# Altium schematic sheet FPGA_Top.SchDoc
size A1; SheetNumber: 1; SheetTotal: 1
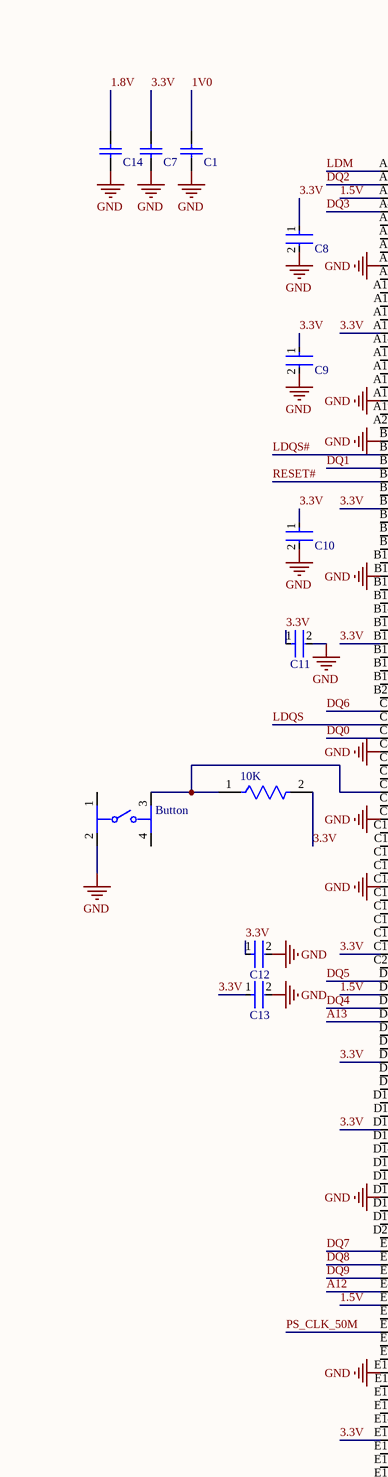
[diagram p0: FPGA_Top.SchDoc, top left]
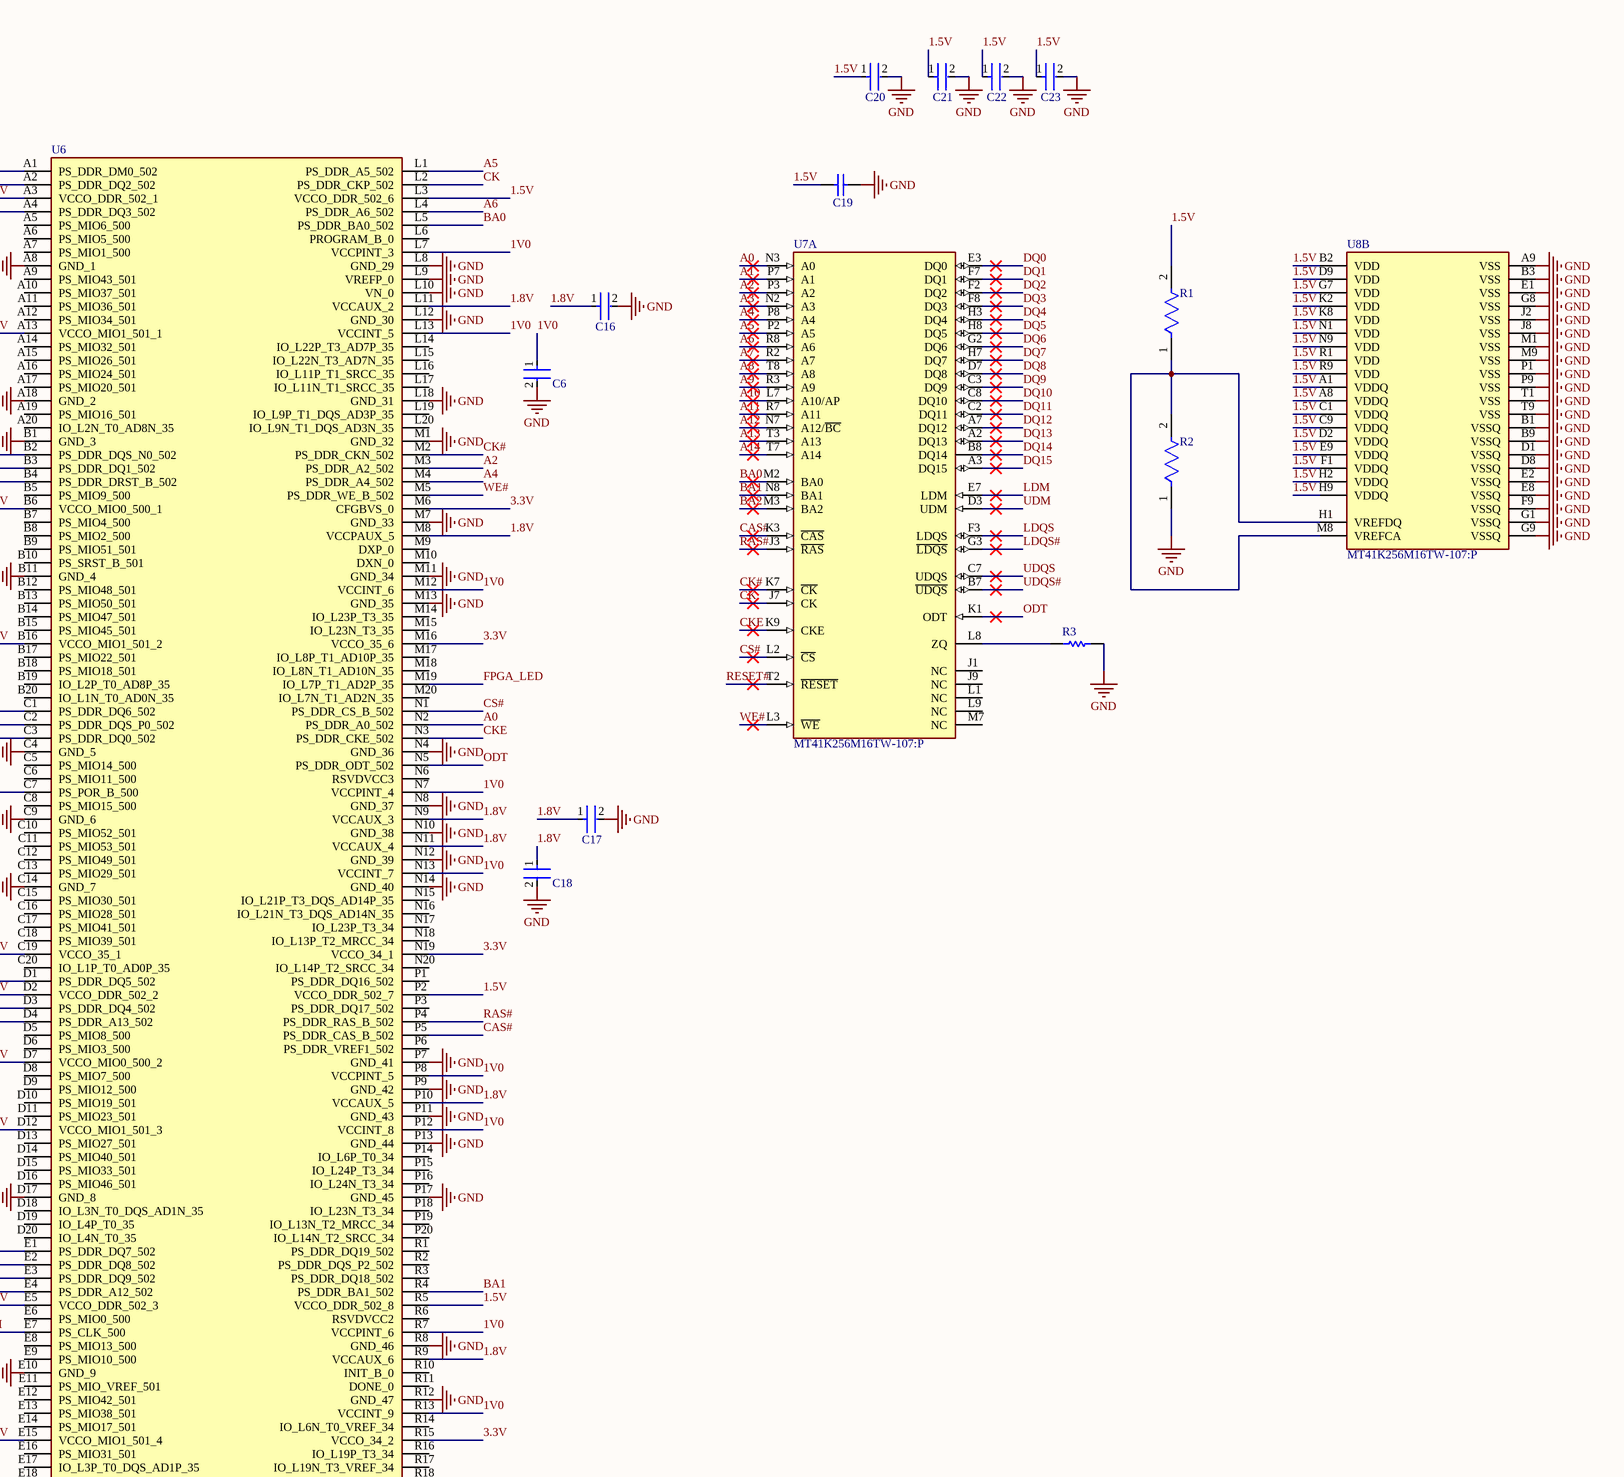
[diagram p1: FPGA_Top.SchDoc, top right]
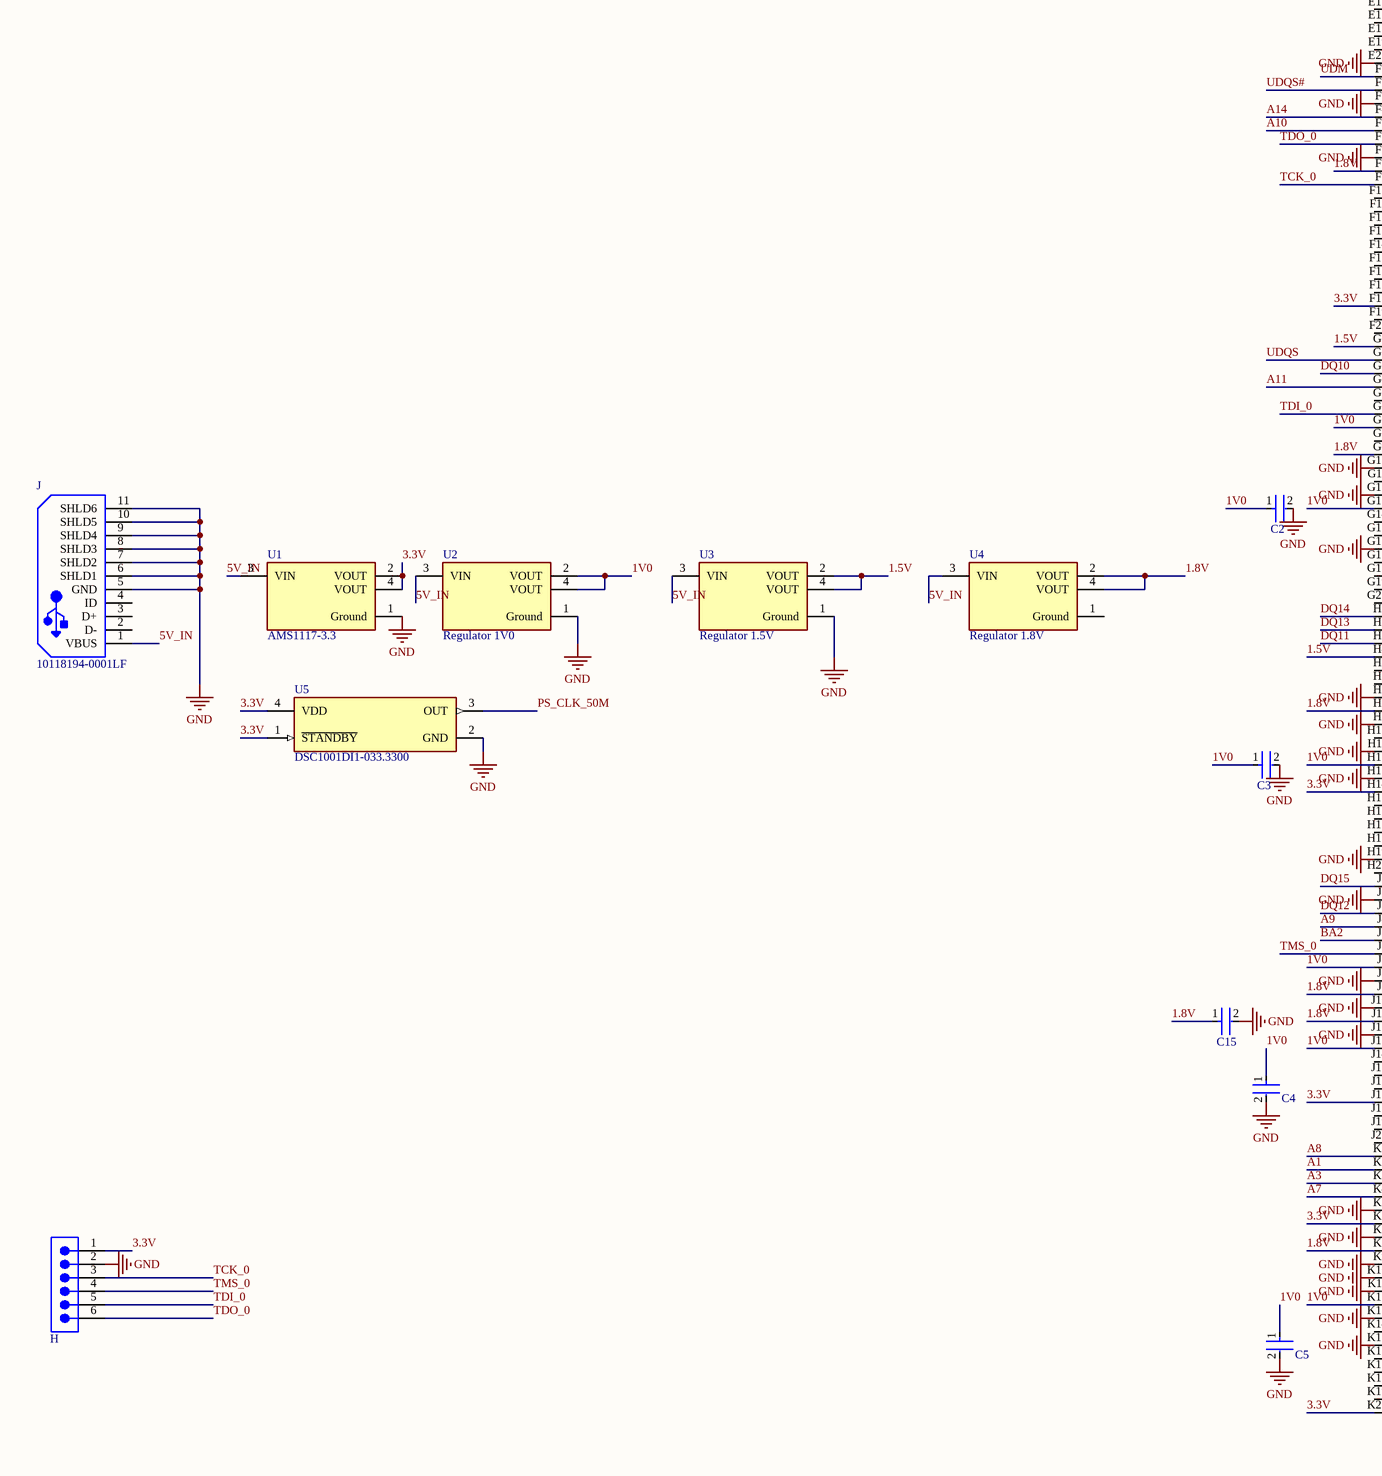
[diagram p2: FPGA_Top.SchDoc, bottom left]
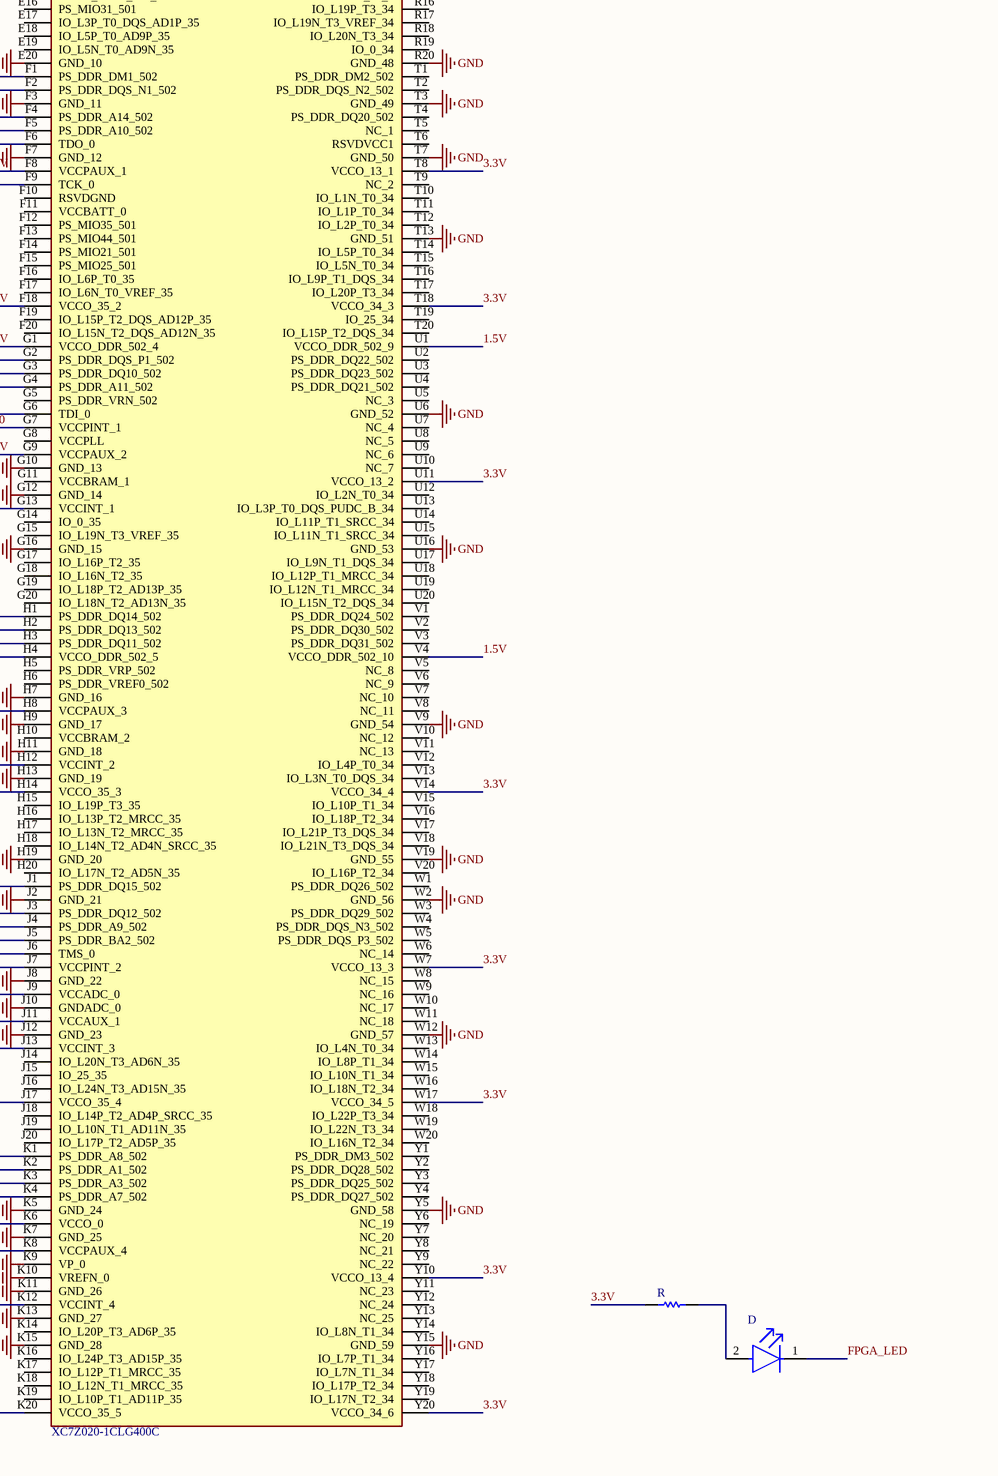
[diagram p3: FPGA_Top.SchDoc, bottom right]

## Parts
10K  RC0402JR-0710KL  [FP-RC0402-0_4-IPC_C]  (value not drawn)
Button  4-1437565-1  [FP-4-1437565-1-MFG]  (value not drawn)
C1  CL10A475KQ8NNNC  [CAPC1608X90X30LL10T20]  (value not drawn)
C2  CC0402KRX7R9BB104  [FP-CC0402-MFG]  (value not drawn)
C3  CC0402KRX7R9BB104  [FP-CC0402-MFG]  (value not drawn)
C4  CC0402KRX7R9BB104  [FP-CC0402-MFG]  (value not drawn)
C5  CC0402KRX7R9BB104  [FP-CC0402-MFG]  (value not drawn)
C6  CC0402KRX7R9BB104  [FP-CC0402-MFG]  (value not drawn)
C7  CL10A475KQ8NNNC  [CAPC1608X90X30LL10T20]  (value not drawn)
C8  CC0402KRX7R9BB104  [FP-CC0402-MFG]  (value not drawn)
C9  CC0402KRX7R9BB104  [FP-CC0402-MFG]  (value not drawn)
C10  CC0402KRX7R9BB104  [FP-CC0402-MFG]  (value not drawn)
C11  CC0402KRX7R9BB104  [FP-CC0402-MFG]  (value not drawn)
C12  CC0402KRX7R9BB104  [FP-CC0402-MFG]  (value not drawn)
C13  CC0402KRX7R9BB104  [FP-CC0402-MFG]  (value not drawn)
C14  CL10A475KQ8NNNC  [CAPC1608X90X30LL10T20]  (value not drawn)
C15  CC0402KRX7R9BB104  [FP-CC0402-MFG]  (value not drawn)
C16  CC0402KRX7R9BB104  [FP-CC0402-MFG]  (value not drawn)
C17  CC0402KRX7R9BB104  [FP-CC0402-MFG]  (value not drawn)
C18  CC0402KRX7R9BB104  [FP-CC0402-MFG]  (value not drawn)
C19  CL10A475KQ8NNNC  [CAPC1608X90X30LL10T20]  (value not drawn)
C20  CC0402KRX7R9BB104  [FP-CC0402-MFG]  (value not drawn)
C21  CC0402KRX7R9BB104  [FP-CC0402-MFG]  (value not drawn)
C22  CC0402KRX7R9BB104  [FP-CC0402-MFG]  (value not drawn)
C23  CC0402KRX7R9BB104  [FP-CC0402-MFG]  (value not drawn)
D  LTST-C190KRKT  [FP-LTST-C190KRKT-MFG]  (value not drawn)
H  TSW-106-07-G-S  [SMTC-TSW-106-07-X-S]  (value not drawn)
J  10118194-0001LF  [FCI-10118194-0001LF-5_V]
R  RC0402JR-07330RL  [RESC1005X40X25NL05T10]  (value not drawn)
R1  RC0402FR-071KL  [FP-RC0402-0_4-IPC_A]  (value not drawn)
R2  RC0402FR-071KL  [FP-RC0402-0_4-IPC_A]  (value not drawn)
R3  240R 1% 0402(1005)  [RESC0402(1005)_L]  (value not drawn)
U1  AMS1117-3.3  [FP-AMS1117-IPC_C]
U2  Regulator 1V0  [FP-AMS1117-IPC_C]
U3  Regulator 1.5V  [FP-AMS1117-IPC_C]
U4  Regulator 1.8V  [FP-AMS1117-IPC_C]
U5  DSC1001DI1-033.3300  [FP-CDFN2520-4LD-PL-1-MFG]
U6  XC7Z020-1CLG400C  [BGA400C80P20X20_1700X1700X160]
U7  MT41K256M16TW-107:P  [FP-TW-IPC_C]  (part A of 2)
U8  MT41K256M16TW-107:P  [FP-TW-IPC_C]  (part B of 2)

## Nets
GND: Button.2 C1.1 C2.2 C3.2 C4.2 C5.2 C6.2 C7.1 C8.2 C9.2 C10.2 C11.2 C12.2 C13.2 C14.1 C15.2 C16.2 C17.2 C18.2 C19.1 C20.2 C21.2 C22.2 C23.2 H.2 J.5(GND) J.6(SHLD1) J.7(SHLD2) J.8(SHLD3) J.9(SHLD4) J.10(SHLD5) J.11(SHLD6) R2.1 R3.2 U1.1(Ground) U2.1(Ground) U3.1(Ground) U5.2(GND) U6.A8(GND_1) U6.A18(GND_2) U6.B1(GND_3) U6.B11(GND_4) U6.C4(GND_5) U6.C9(GND_6) U6.C14(GND_7) U6.D17(GND_8) U6.E10(GND_9) U6.E20(GND_10) U6.F3(GND_11) U6.F7(GND_12) U6.G10(GND_13) U6.G12(GND_14) U6.G16(GND_15) U6.H7(GND_16) U6.H9(GND_17) U6.H11(GND_18) U6.H13(GND_19) U6.H19(GND_20) U6.J2(GND_21) U6.J8(GND_22) U6.J10(GNDADC_0) U6.J12(GND_23) U6.K5(GND_24) U6.K7(GND_25) U6.K9(VP_0) U6.K10(VREFN_0) U6.K11(GND_26) U6.K13(GND_27) U6.K15(GND_28) U6.L8(GND_29) U6.L9(VREFP_0) U6.L10(VN_0) U6.L12(GND_30) U6.L18(GND_31) U6.M1(GND_32) U6.M7(GND_33) U6.M11(GND_34) U6.M13(GND_35) U6.N4(GND_36) U6.N8(GND_37) U6.N10(GND_38) U6.N12(GND_39) U6.N14(GND_40) U6.P7(GND_41) U6.P9(GND_42) U6.P11(GND_43) U6.P13(GND_44) U6.P17(GND_45) U6.R8(GND_46) U6.R12(GND_47) U6.R20(GND_48) U6.T3(GND_49) U6.T7(GND_50) U6.T13(GND_51) U6.U6(GND_52) U6.U16(GND_53) U6.V9(GND_54) U6.V19(GND_55) U6.W2(GND_56) U6.W12(GND_57) U6.Y5(GND_58) U6.Y15(GND_59) U8.A9(VSS) U8.B1(VSSQ) U8.B3(VSS) U8.B9(VSSQ) U8.D1(VSSQ) U8.D8(VSSQ) U8.E1(VSS) U8.E2(VSSQ) U8.E8(VSSQ) U8.F9(VSSQ) U8.G1(VSSQ) U8.G8(VSS) U8.G9(VSSQ) U8.J2(VSS) U8.J8(VSS) U8.M1(VSS) U8.M9(VSS) U8.P1(VSS) U8.P9(VSS) U8.T1(VSS) U8.T9(VSS)
1.5V: C19.2 C20.1 C21.1 C22.1 C23.1 R1.2 U3.2(VOUT) U3.4(VOUT) U6.A3(VCCO_DDR_502_1) U6.D2(VCCO_DDR_502_2) U6.E5(VCCO_DDR_502_3) U6.G1(VCCO_DDR_502_4) U6.H4(VCCO_DDR_502_5) U6.L3(VCCO_DDR_502_6) U6.P2(VCCO_DDR_502_7) U6.R5(VCCO_DDR_502_8) U6.U1(VCCO_DDR_502_9) U6.V4(VCCO_DDR_502_10) U8.A1(VDDQ) U8.A8(VDDQ) U8.B2(VDD) U8.C1(VDDQ) U8.C9(VDDQ) U8.D2(VDDQ) U8.D9(VDD) U8.E9(VDDQ) U8.F1(VDDQ) U8.G7(VDD) U8.H2(VDDQ) U8.H9(VDDQ) U8.K2(VDD) U8.K8(VDD) U8.N1(VDD) U8.N9(VDD) U8.R1(VDD) U8.R9(VDD)
1.8V: C14.2 C15.1 C16.1 C17.1 C18.1 U4.2(VOUT) U4.4(VOUT) U6.F8(VCCPAUX_1) U6.G9(VCCPAUX_2) U6.H8(VCCPAUX_3) U6.J9(VCCADC_0) U6.J11(VCCAUX_1) U6.K8(VCCPAUX_4) U6.L11(VCCAUX_2) U6.M8(VCCPAUX_5) U6.N9(VCCAUX_3) U6.N11(VCCAUX_4) U6.P10(VCCAUX_5) U6.R9(VCCAUX_6)
1V0: C1.2 C2.1 C3.1 C4.1 C5.1 C6.1 U2.2(VOUT) U2.4(VOUT) U6.G7(VCCPINT_1) U6.G13(VCCINT_1) U6.H12(VCCINT_2) U6.J7(VCCPINT_2) U6.J13(VCCINT_3) U6.K12(VCCINT_4) U6.L7(VCCPINT_3) U6.L13(VCCINT_5) U6.M12(VCCINT_6) U6.N7(VCCPINT_4) U6.N13(VCCINT_7) U6.P8(VCCPINT_5) U6.P12(VCCINT_8) U6.R7(VCCPINT_6) U6.R13(VCCINT_9)
3.3V: 10K.2 C7.2 C8.1 C9.1 C10.1 C11.1 C12.1 C13.1 H.1 R.1 U1.2(VOUT) U1.4(VOUT) U5.1(~{STANDBY}) U5.4(VDD) U6.A13(VCCO_MIO1_501_1) U6.B6(VCCO_MIO0_500_1) U6.B16(VCCO_MIO1_501_2) U6.C19(VCCO_35_1) U6.D7(VCCO_MIO0_500_2) U6.D12(VCCO_MIO1_501_3) U6.E15(VCCO_MIO1_501_4) U6.F18(VCCO_35_2) U6.H14(VCCO_35_3) U6.J17(VCCO_35_4) U6.K6(VCCO_0) U6.K20(VCCO_35_5) U6.M6(CFGBVS_0) U6.M16(VCCO_35_6) U6.N19(VCCO_34_1) U6.R15(VCCO_34_2) U6.T8(VCCO_13_1) U6.T18(VCCO_34_3) U6.U11(VCCO_13_2) U6.V14(VCCO_34_4) U6.W7(VCCO_13_3) U6.W17(VCCO_34_5) U6.Y10(VCCO_13_4) U6.Y20(VCCO_34_6)
5V_IN: J.1(VBUS) U1.3(VIN) U2.3(VIN) U3.3(VIN) U4.3(VIN)
A0: U6.N2(PS_DDR_A0_502) U7.N3(A0)
A1: U6.K2(PS_DDR_A1_502) U7.P7(A1)
A2: U6.M3(PS_DDR_A2_502) U7.P3(A2)
A3: U6.K3(PS_DDR_A3_502) U7.N2(A3)
A4: U6.M4(PS_DDR_A4_502) U7.P8(A4)
A5: U6.L1(PS_DDR_A5_502) U7.P2(A5)
A6: U6.L4(PS_DDR_A6_502) U7.R8(A6)
A7: U6.K4(PS_DDR_A7_502) U7.R2(A7)
A8: U6.K1(PS_DDR_A8_502) U7.T8(A8)
A9: U6.J4(PS_DDR_A9_502) U7.R3(A9)
A10: U6.F5(PS_DDR_A10_502) U7.L7(A10/AP)
A11: U6.G4(PS_DDR_A11_502) U7.R7(A11)
A12: U6.E4(PS_DDR_A12_502) U7.N7(A12/~{BC})
A13: U6.D4(PS_DDR_A13_502) U7.T3(A13)
A14: U6.F4(PS_DDR_A14_502) U7.T7(A14)
BA0: U6.L5(PS_DDR_BA0_502) U7.M2(BA0)
BA1: U6.R4(PS_DDR_BA1_502) U7.N8(BA1)
BA2: U6.J5(PS_DDR_BA2_502) U7.M3(BA2)
CAS#: U6.P5(PS_DDR_CAS_B_502) U7.K3(~{CAS})
CK: U6.L2(PS_DDR_CKP_502) U7.J7(CK)
CK#: U6.M2(PS_DDR_CKN_502) U7.K7(~{CK})
CKE: U6.N3(PS_DDR_CKE_502) U7.K9(CKE)
CS#: U6.N1(PS_DDR_CS_B_502) U7.L2(~{CS})
DQ0: U6.C3(PS_DDR_DQ0_502) U7.E3(DQ0)
DQ1: U6.B3(PS_DDR_DQ1_502) U7.F7(DQ1)
DQ2: U6.A2(PS_DDR_DQ2_502) U7.F2(DQ2)
DQ3: U6.A4(PS_DDR_DQ3_502) U7.F8(DQ3)
DQ4: U6.D3(PS_DDR_DQ4_502) U7.H3(DQ4)
DQ5: U6.D1(PS_DDR_DQ5_502) U7.H8(DQ5)
DQ6: U6.C1(PS_DDR_DQ6_502) U7.G2(DQ6)
DQ7: U6.E1(PS_DDR_DQ7_502) U7.H7(DQ7)
DQ8: U6.E2(PS_DDR_DQ8_502) U7.D7(DQ8)
DQ9: U6.E3(PS_DDR_DQ9_502) U7.C3(DQ9)
DQ10: U6.G3(PS_DDR_DQ10_502) U7.C8(DQ10)
DQ11: U6.H3(PS_DDR_DQ11_502) U7.C2(DQ11)
DQ12: U6.J3(PS_DDR_DQ12_502) U7.A7(DQ12)
DQ13: U6.H2(PS_DDR_DQ13_502) U7.A2(DQ13)
DQ14: U6.H1(PS_DDR_DQ14_502) U7.B8(DQ14)
DQ15: U6.J1(PS_DDR_DQ15_502) U7.A3(DQ15)
FPGA_LED: D.1(C) U6.M19(IO_L7P_T1_AD2P_35)
LDM: U6.A1(PS_DDR_DM0_502) U7.E7(LDM)
LDQS: U6.C2(PS_DDR_DQS_P0_502) U7.F3(LDQS)
LDQS#: U6.B2(PS_DDR_DQS_N0_502) U7.G3(~{LDQS})
ODT: U6.N5(PS_DDR_ODT_502) U7.K1(ODT)
PS_CLK_50M: U5.3(OUT) U6.E7(PS_CLK_500)
RAS#: U6.P4(PS_DDR_RAS_B_502) U7.J3(~{RAS})
RESET#: U6.B4(PS_DDR_DRST_B_502) U7.T2(~{RESET})
TCK_0: H.3 U6.F9(TCK_0)
TDI_0: H.5 U6.G6(TDI_0)
TDO_0: H.6 U6.F6(TDO_0)
TMS_0: H.4 U6.J6(TMS_0)
UDM: U6.F1(PS_DDR_DM1_502) U7.D3(UDM)
UDQS: U6.G2(PS_DDR_DQS_P1_502) U7.C7(UDQS)
UDQS#: U6.F2(PS_DDR_DQS_N1_502) U7.B7(~{UDQS})
WE#: U6.M5(PS_DDR_WE_B_502) U7.L3(~{WE})
Net10K_1: 10K.1 Button.3 U6.C7(PS_POR_B_500)
NetD_2: D.2(A) R.2
NetR1_1: R1.1 R2.2 U8.H1(VREFDQ) U8.M8(VREFCA)
NetR3_1: R3.1 U7.L8(ZQ)

Not connected (* = marked no-connect by the designer): Button 1 4; J 2(D-) 3(D+) 4(ID); U4 1(Ground); U6 A5(PS_MIO6_500) A6(PS_MIO5_500) A7(PS_MIO1_500) A9(PS_MIO43_501) A10(PS_MIO37_501) A11(PS_MIO36_501) A12(PS_MIO34_501) A14(PS_MIO32_501) A15(PS_MIO26_501) A16(PS_MIO24_501) A17(PS_MIO20_501) A19(PS_MIO16_501) A20(IO_L2N_T0_AD8N_35) B5(PS_MIO9_500) B7(PS_MIO4_500) B8(PS_MIO2_500) B9(PS_MIO51_501) B10(PS_SRST_B_501) B12(PS_MIO48_501) B13(PS_MIO50_501) B14(PS_MIO47_501) B15(PS_MIO45_501) B17(PS_MIO22_501) B18(PS_MIO18_501) B19(IO_L2P_T0_AD8P_35) B20(IO_L1N_T0_AD0N_35) C5(PS_MIO14_500) C6(PS_MIO11_500) C8(PS_MIO15_500) C10(PS_MIO52_501) C11(PS_MIO53_501) C12(PS_MIO49_501) C13(PS_MIO29_501) C15(PS_MIO30_501) C16(PS_MIO28_501) C17(PS_MIO41_501) C18(PS_MIO39_501) C20(IO_L1P_T0_AD0P_35) D5(PS_MIO8_500) D6(PS_MIO3_500) D8(PS_MIO7_500) D9(PS_MIO12_500) D10(PS_MIO19_501) D11(PS_MIO23_501) D13(PS_MIO27_501) D14(PS_MIO40_501) D15(PS_MIO33_501) D16(PS_MIO46_501) D18(IO_L3N_T0_DQS_AD1N_35) D19(IO_L4P_T0_35) D20(IO_L4N_T0_35) E6(PS_MIO0_500) E8(PS_MIO13_500) E9(PS_MIO10_500) E11(PS_MIO_VREF_501) E12(PS_MIO42_501) E13(PS_MIO38_501) E14(PS_MIO17_501) E16(PS_MIO31_501) E17(IO_L3P_T0_DQS_AD1P_35) E18(IO_L5P_T0_AD9P_35) E19(IO_L5N_T0_AD9N_35) F10(RSVDGND) F11(VCCBATT_0) F12(PS_MIO35_501) F13(PS_MIO44_501) F14(PS_MIO21_501) F15(PS_MIO25_501) F16(IO_L6P_T0_35) F17(IO_L6N_T0_VREF_35) F19(IO_L15P_T2_DQS_AD12P_35) F20(IO_L15N_T2_DQS_AD12N_35) G5(PS_DDR_VRN_502) G8(VCCPLL) G11(VCCBRAM_1) G14(IO_0_35) G15(IO_L19N_T3_VREF_35) G17(IO_L16P_T2_35) G18(IO_L16N_T2_35) G19(IO_L18P_T2_AD13P_35) G20(IO_L18N_T2_AD13N_35) H5(PS_DDR_VRP_502) H6(PS_DDR_VREF0_502) H10(VCCBRAM_2) H15(IO_L19P_T3_35) H16(IO_L13P_T2_MRCC_35) H17(IO_L13N_T2_MRCC_35) H18(IO_L14N_T2_AD4N_SRCC_35) H20(IO_L17N_T2_AD5N_35) J14(IO_L20N_T3_AD6N_35) J15(IO_25_35) J16(IO_L24N_T3_AD15N_35) J18(IO_L14P_T2_AD4P_SRCC_35) J19(IO_L10N_T1_AD11N_35) J20(IO_L17P_T2_AD5P_35) K14(IO_L20P_T3_AD6P_35) K16(IO_L24P_T3_AD15P_35) K17(IO_L12P_T1_MRCC_35) K18(IO_L12N_T1_MRCC_35) K19(IO_L10P_T1_AD11P_35) L6(PROGRAM_B_0) L14(IO_L22P_T3_AD7P_35) L15(IO_L22N_T3_AD7N_35) L16(IO_L11P_T1_SRCC_35) L17(IO_L11N_T1_SRCC_35) L19(IO_L9P_T1_DQS_AD3P_35) L20(IO_L9N_T1_DQS_AD3N_35) M9(DXP_0) M10(DXN_0) M14(IO_L23P_T3_35) M15(IO_L23N_T3_35) M17(IO_L8P_T1_AD10P_35) M18(IO_L8N_T1_AD10N_35) M20(IO_L7N_T1_AD2N_35) N6(RSVDVCC3) N15(IO_L21P_T3_DQS_AD14P_35) N16(IO_L21N_T3_DQS_AD14N_35) N17(IO_L23P_T3_34) N18(IO_L13P_T2_MRCC_34) N20(IO_L14P_T2_SRCC_34) P1(PS_DDR_DQ16_502) P3(PS_DDR_DQ17_502) P6(PS_DDR_VREF1_502) P14(IO_L6P_T0_34) P15(IO_L24P_T3_34) P16(IO_L24N_T3_34) P18(IO_L23N_T3_34) P19(IO_L13N_T2_MRCC_34) P20(IO_L14N_T2_SRCC_34) R1(PS_DDR_DQ19_502) R2(PS_DDR_DQS_P2_502) R3(PS_DDR_DQ18_502) R6(RSVDVCC2) R10(INIT_B_0) R11(DONE_0) R14(IO_L6N_T0_VREF_34) R16(IO_L19P_T3_34) R17(IO_L19N_T3_VREF_34) R18(IO_L20N_T3_34) R19(IO_0_34) T1(PS_DDR_DM2_502) T2(PS_DDR_DQS_N2_502) T4(PS_DDR_DQ20_502) T5(NC_1) T6(RSVDVCC1) T9(NC_2) T10(IO_L1N_T0_34) T11(IO_L1P_T0_34) T12(IO_L2P_T0_34) T14(IO_L5P_T0_34) T15(IO_L5N_T0_34) T16(IO_L9P_T1_DQS_34) T17(IO_L20P_T3_34) T19(IO_25_34) T20(IO_L15P_T2_DQS_34) U2(PS_DDR_DQ22_502) U3(PS_DDR_DQ23_502) U4(PS_DDR_DQ21_502) U5(NC_3) U7(NC_4) U8(NC_5) U9(NC_6) U10(NC_7) U12(IO_L2N_T0_34) U13(IO_L3P_T0_DQS_PUDC_B_34) U14(IO_L11P_T1_SRCC_34) U15(IO_L11N_T1_SRCC_34) U17(IO_L9N_T1_DQS_34) U18(IO_L12P_T1_MRCC_34) U19(IO_L12N_T1_MRCC_34) U20(IO_L15N_T2_DQS_34) V1(PS_DDR_DQ24_502) V2(PS_DDR_DQ30_502) V3(PS_DDR_DQ31_502) V5(NC_8) V6(NC_9) V7(NC_10) V8(NC_11) V10(NC_12) V11(NC_13) V12(IO_L4P_T0_34) V13(IO_L3N_T0_DQS_34) V15(IO_L10P_T1_34) V16(IO_L18P_T2_34) V17(IO_L21P_T3_DQS_34) V18(IO_L21N_T3_DQS_34) V20(IO_L16P_T2_34) W1(PS_DDR_DQ26_502) W3(PS_DDR_DQ29_502) W4(PS_DDR_DQS_N3_502) W5(PS_DDR_DQS_P3_502) W6(NC_14) W8(NC_15) W9(NC_16) W10(NC_17) W11(NC_18) W13(IO_L4N_T0_34) W14(IO_L8P_T1_34) W15(IO_L10N_T1_34) W16(IO_L18N_T2_34) W18(IO_L22P_T3_34) W19(IO_L22N_T3_34) W20(IO_L16N_T2_34) Y1(PS_DDR_DM3_502) Y2(PS_DDR_DQ28_502) Y3(PS_DDR_DQ25_502) Y4(PS_DDR_DQ27_502) Y6(NC_19) Y7(NC_20) Y8(NC_21) Y9(NC_22) Y11(NC_23) Y12(NC_24) Y13(NC_25) Y14(IO_L8N_T1_34) Y16(IO_L7P_T1_34) Y17(IO_L7N_T1_34) Y18(IO_L17P_T2_34) Y19(IO_L17N_T2_34); U7 J1(NC) J9(NC) L1(NC) L9(NC) M7(NC)

## Library data of the parts
10K = CMP-2002-07915-3: RES 10K OHM 5% 1/16W 0402; Max Power Dissipation: 63mW; Temperature Coefficient: 100ppm/°C; Power Rating: 62.5mW; Resistance: 10kR; Voltage Rating: 50V; Size Code: 0402; Resistance Tolerance: 5%; Packaging: Tape and Reel; Case Code (Metric): 1005; Lead Free: Lead Free; Resistor Type: Thick Film; Min Operating Temperature: -55°C; Military Standard: Not; Depth: 0.5mm; Series: RC; Case/Package: 0402; Construction: Rectangular; Number of Terminations: 2; Package Quantity: 1; Termination: SMD/SMT; Length: 0.039inch; Case Code (Imperial): 0402; Height: 0.016inch; Features: Moisture Resistant; RoHS Compliant: Yes; Max Operating Temperature: 155°C; Tolerance: 5%; Width: 0.02inch
Button = CMP-03407-000003-1: SWITCH TACTILE SPST-NO 0.05A 24V; Manufacturer: TE Connectivity; Ciiva Ids: 2672442; Contact Current Rating: 50mA; Operating Force: 160gf; Contact Resistance: 100mΩ; Electromechanical Life: 100000Cycles; Standoff Height: 0.05mm; Import Ts: 1521848451; Category: Switch; ComponentLink2Description: Datasheet; Mount: Surface Mount; Digikey Description: SWITCH TACTILE SPST-NO 0.05A 24V; Device Class L3: Tactile Switches; Release Date: 1503379960; Octopart: https://octopart.com/fsm4jsma-te+connectivity-55488004; Temperature Range Low: -35°C; Lead Free: Yes; RoHS: TRUE; Mouser Description: Switch Tactile OFF (ON) SPST Round Button Gull Wing 0.05A 12VDC 1.57N SMD Loose Piece; Voltage Rating Dc: 24V; ComponentLink2URL: https://www.te.com/commerce/DocumentDelivery/DDEController?Action=showdoc&DocId=Customer+Drawing%7F2-1437565-7%7FV%7Fpdf%7FEnglish%7FENG_CD_2-1437565-7_V.pdf%7F4-1437565-1; Height: 5.38mm; Package: 0; Temperature Range High: +85°C; Device Class L2: Switches; Manufacturer Part Number: 4-1437565-1; Temperature: -35°C to +85°C; Device Class L1: Electromechanical; Automotive: No; Throw Configuration: SPST-NO
C1 C7 C14 C19 = CMP-2000-06090-1: Chip Capacitor, 4.7 uF, +/- 10%, 6.3 V, -55 to 85 degC, 0603 (1608 Metric), RoHS, Tape and Reel; Manufacturer: Samsung Electro-Mechanics; Dielectric: X5R; Capacitance: 4700000pF; Rated Voltage: 6.3V; Manufacturer URL: http://www.samsungsem.com/global/index.jsp; Case Size/Dimension: 0603; Package Description: 2-Pin Surface Mount Device, Body 1.60 x 0.80 mm; Datasheet Version: 07/2016; Datasheet URL: http://www.samsungsem.com/kr/support/product-search/mlcc/__icsFiles/afieldfile/2016/08/18/S_CL10A475KQ8NNNC.pdf; Tolerance (%): ±10%; Mounting Technology: SurfaceMount; Package Reference: 0603
C2-C6 C8-C13 C15-C18 C20-C23 = CMP-03422-001010-1: CAP CER 0.1UF 50V X7R 0402; Manufacturer: YAGEO; Capacitance: 100 nF; Temperature Coefficient: 30ppm/°C; Material: Ceramic; Value: 100 nF; Automotive Grade: NA; Tolerance: 0.1; Footprint Url: http://www.yageo.com/exep/pages/download/literatures/UPY-C_GEN_24.pdf; Category: Cap; Package: CC0402; Voltage Rating: 50 V; ComponentLink2Description: Datasheet; Temperature Characteristic: X7R; Device Class L1: Passive Components; Device Class L2: Capacitors; Digikey Description: CAP CER 0.1UF 50V X7R 0402; Octopart: https://octopart.com/cc0402krx7r9bb104-yageo-56536067; Device Class L3: Ceramic Capacitors; Height: 0.55mm; Temperature: -55°C to +125°C; Temperature Range High: +125°C; ComponentLink2URL: http://www.yageo.com/documents/recent/UPY-GP_NP0_16V-to-50V_16.pdf; Temperature Range Low: -55°C; RoHS: TRUE; Ipc Land Pattern Name: CAPC10050X50; Lead Free: Yes; Automotive: No; Manufacturer Part Number: CC0402KRX7R9BB104
D = CMP-1674-00011-2: LED RED CLEAR CHIP SMD; Reverse Voltage: 5V; Viewing Angle: 130°; Power Rating: 75mW; Test Current: 20mA; Number of Elements: 1; Lens Color: Colorless; Wavelength: 639nm; Dominant Wavelength: 631nm; Lens Style: Diffused; Forward Current: 30mA; Forward Voltage: 2.4V; Luminous Intensity: 54mcd; Color: Red; Case Code (Imperial): 0603; Lens Transparency: Clear; Lead Free: Lead Free; Package Quantity: 1; Packaging: Tape and Reel; Max Operating Temperature: 85°C; Number of Pins: 2; Height: 0.8mm; Case/Package: 0603; Number of LEDs: 1; Width: 0.8mm; Case Code (Metric): 1608; Depth: 0.8mm; Mount: Surface Mount; Radiation Hardening: No; Length: 1.6mm; Illumination Color: Red; Power Dissipation: 75mW; Min Operating Temperature: -55°C
H = CMP-1024-00383-1: 0.025" SQ Post Header, Through-hole, Vertical, -55 to 125 degC, 2.54 mm Pitch, 6-Pin, Male, RoHS; Manufacturer: Samtec; Pitch: 2.54 mm; RoHS: True; ComponentLink1Description: Manufacturer URL; DatasheetVersion: F-214; Orientation: Vertical; ComponentLink1URL: http://www.samtec.com; ComponentLink3Description: Package Specification; ComponentLink2Description: Datasheet; PackageVersion: DM, 8/1988; PackageDescription: .025[0.64] SQ. Post Terminal Strip Assembly; PackageReference: TSW-106-07-X-S; Mounting Technology: Through-hole; Temperature Range: -55 to 125 degC; ComponentLink3URL: http://www.samtec.com/documents/webfiles/cpdf/TSW-XXX-XX-XXX-X-XX-XXX-MKT.pdf; ComponentLink2URL: http://www.samtec.com/documents/webfiles/pdf/TSW_TH.PDF; PartNumber: TSW-106-07-G-S
J = CMP-2000-05120-1: Micro USB B Type Receptacle, 1.8 A, -55 to 85 degC, 5-Pin SMD, RoHS, Tape and Reel; Manufacturer: Amphenol FCI; Body Orientation: RightAngle; Number of Contacts: 5; Pitch: 0.65mm; Gender: RCP; Rad Hard: No; Package Reference: 10118194-0001LF-5; Mounting: SurfaceMount; Manufacturer URL: http://www.fci.com/; Packaging: CutTape; Datasheet URL: https://datasheet.ciiva.com/26945/getdatasheetpartid-418619-26945695.pdf; Termination Method: Solder; Package Description: 5-Pin Surface Mount Device, Body 8.05 x 5.53 mm, Pitch 0.65 mm; Type: MicroUSBTypeB; Datasheet Version: Rev. A, 10/2011
R = CMP-2002-07985-1: Manufacturer: Yageo / Phycomp; Part Number: RC0402JR-07330RL
R1 R2 = CMP-2002-07472-3: RES 1K OHM 1% 1/16W 0402; Max Power Dissipation: 63mW; Resistance: 1kR; Voltage Rating (DC): 50V; Temperature Coefficient: 100ppm/°C; Power Rating: 62.5mW; Technology: THICK FILM; Size Code: 0402; Series: RC; Length: 1mm; Case/Package: 0402; Features: Moisture Resistant; Termination: SMD/SMT; Case Code (Metric): 1005; Reach SVHC Compliant: Yes; Number of Terminations: 2; Tolerance: 1%; Lead Free: Lead Free; Military Standard: Not; Resistor Type: Thick Film; Max Operating Temperature: 155°C; RoHS Compliant: Yes; Construction: Rectangular; Voltage Rating: 50V; Packaging: Tape and Reel; Height: 0.32mm; Number of Pins: 2; Resistance Tolerance: 1%; Case Code (Imperial): 0402; Depth: 0.5mm; Min Operating Temperature: -55°C; Width: 0.5mm
R3 = CMP-1011-00438-1: 240R 0.063W 1% 0402 (1005 Metric)  SMD; Case-Metric: 1005; Case-EIA: 0402; Value: 240.00 Ohm; Power: 0.063 W; Tolerance: 1 %; Technology: SMT
U1 = CMP-209535-000001-1: LDO Voltage Regulators 1A, 3.3V; Manufacturer: Advanced Monolithic Systems; Dropout Voltage: 1.1V; Output Type: Fixed; Nominal Supply Current: 5mA; Max Power Dissipation: 1.2W; Max Supply Voltage: 15V; Number Of Outputs: 1; Standoff Height: 0.64mm; Max Junction Temp: +125°C; Height: 1.8mm; Package: AMS1117; Device Class L2: Power Management ICs; ComponentLink2Description: Datasheet; ComponentLink2URL: http://www.advanced-monolithic.com/pdf/ds1117.pdf; Category: IC; RoHS: TRUE; Automotive: No; Device Class L1: Integrated Circuits (ICs); Output Current: 1A; Device Class L3: Voltage Regulators - Linear; Temperature: -40°C to +125°C; Output Voltage: 3.3V; Manufacturer Part Number: AMS1117-3.3; Temperature Range Low: -40°C; Octopart: https://octopart.com/ams1117-3.3-advanced+monolithic+systems-25899300; Lead Free: Yes; Ipc Land Pattern Name: SOT229P700X180-4; Temperature Range High: +125°C
U2-U4 = CMP-209535-000001-1: LDO Voltage Regulators 1A, 3.3V; Manufacturer Part Number: AMS1117-3.3; Manufacturer: Advanced Monolithic Systems; Dropout Voltage: 1.1V; Output Type: Fixed; Nominal Supply Current: 5mA; Max Power Dissipation: 1.2W; Max Supply Voltage: 15V; Number Of Outputs: 1; Standoff Height: 0.64mm; Max Junction Temp: +125°C; Height: 1.8mm; Package: AMS1117; Device Class L2: Power Management ICs; ComponentLink2Description: Datasheet; ComponentLink2URL: http://www.advanced-monolithic.com/pdf/ds1117.pdf; Category: IC; RoHS: TRUE; Automotive: No; Device Class L1: Integrated Circuits (ICs); Output Current: 1A; Device Class L3: Voltage Regulators - Linear; Temperature: -40°C to +125°C; Output Voltage: 3.3V; Temperature Range Low: -40°C; Octopart: https://octopart.com/ams1117-3.3-advanced+monolithic+systems-25899300; Lead Free: Yes; Ipc Land Pattern Name: SOT229P700X180-4; Temperature Range High: +125°C
U5 = CMP-06255-000023-1: MEMS OSC XO 33.3300MHZ CMOS SMD; Operating Supply Voltage: 3.3V; Min Supply Voltage: 1.7V; Frequency Stability: 50ppm; Load Capacitance: 15pF; Max Supply Voltage: 3.6V; Max Duty Cycle: 55%; Frequency: 33.33MHz; Max Supply Current: 7.2mA; Termination: Solder; Ratings: AEC-Q100; Length: 0.098inch; Height: 0.035inch; Min Operating Temperature: -40°C; Package Quantity: 140; Lead Free: Lead Free; Case/Package: SMD/SMT; Packaging: Rail/Tube; Max Operating Temperature: 85°C; Width: 0.079inch; Series: DSC1001; Mount: Surface Mount; RoHS Compliant: Yes
U6 = CMP-014-000000-1: Zynq-7000 All Programmable SoC, BGA-400; Manufacturer_Name: AMD; Geometry.Height: 1.6mm; Mouser Part Number: 217-XC7Z020-1CLG400C; Arrow Price/Stock: *; Mouser Price/Stock: https://www.mouser.co.uk/ProductDetail/AMD-Xilinx/XC7Z020-1CLG400C?qs=rrS6PyfT74eaxuOsP%2FGL4g%3D%3D; Design Item ID: XC7Z020-1CLG400C; Source: XC7Z020-1CLG400C.SchLib; Datasheet Link: http://www.xilinx.com/support/documentation/data_sheets/ds190-Zynq-7000-Overview.pdf; Manufacturer_Part_Number: XC7Z020-1CLG400C; Arrow Part Number: *
U7 U8 = CMP-2000-07475-2: IC DRAM 4G PARALLEL 96FBGA; Manufacturer: Micron; Access Time: 1.07ns; Nominal Supply Current: 12-156mA; Min Supply Voltage: 1.283V; Memory Type: SDRAM,DDR3; Standoff Height: 0.29mm; Max Supply Voltage: 1.45V; Memory Size: 4Gbits; Device Class L1: Integrated Circuits (ICs); Lead Free: Yes; ComponentLink2Description: Datasheet; Manufacturer Part Number: MT41K256M16TW-107:P; Category: IC; Digikey Description: IC DRAM 4G PARALLEL 96FBGA; Device Class L3: RAM; Interface: Parallel; RoHS: TRUE; Octopart: https://octopart.com/mt41k256m16tw-107%3Ap-micron-66533852; Temperature Range High: +85°C; ComponentLink2URL: https://www.micron.com/-/media/client/global/documents/products/data-sheet/dram/ddr3/4gb_ddr3l.pdf; Temperature: 0°C to +85°C; Package: TW; Device Class L2: Memory; Automotive: No; Height: 1.2mm; Temperature Range Low: 0°C